# EAGLE design apr-27 (EAGLE 7.6.0)
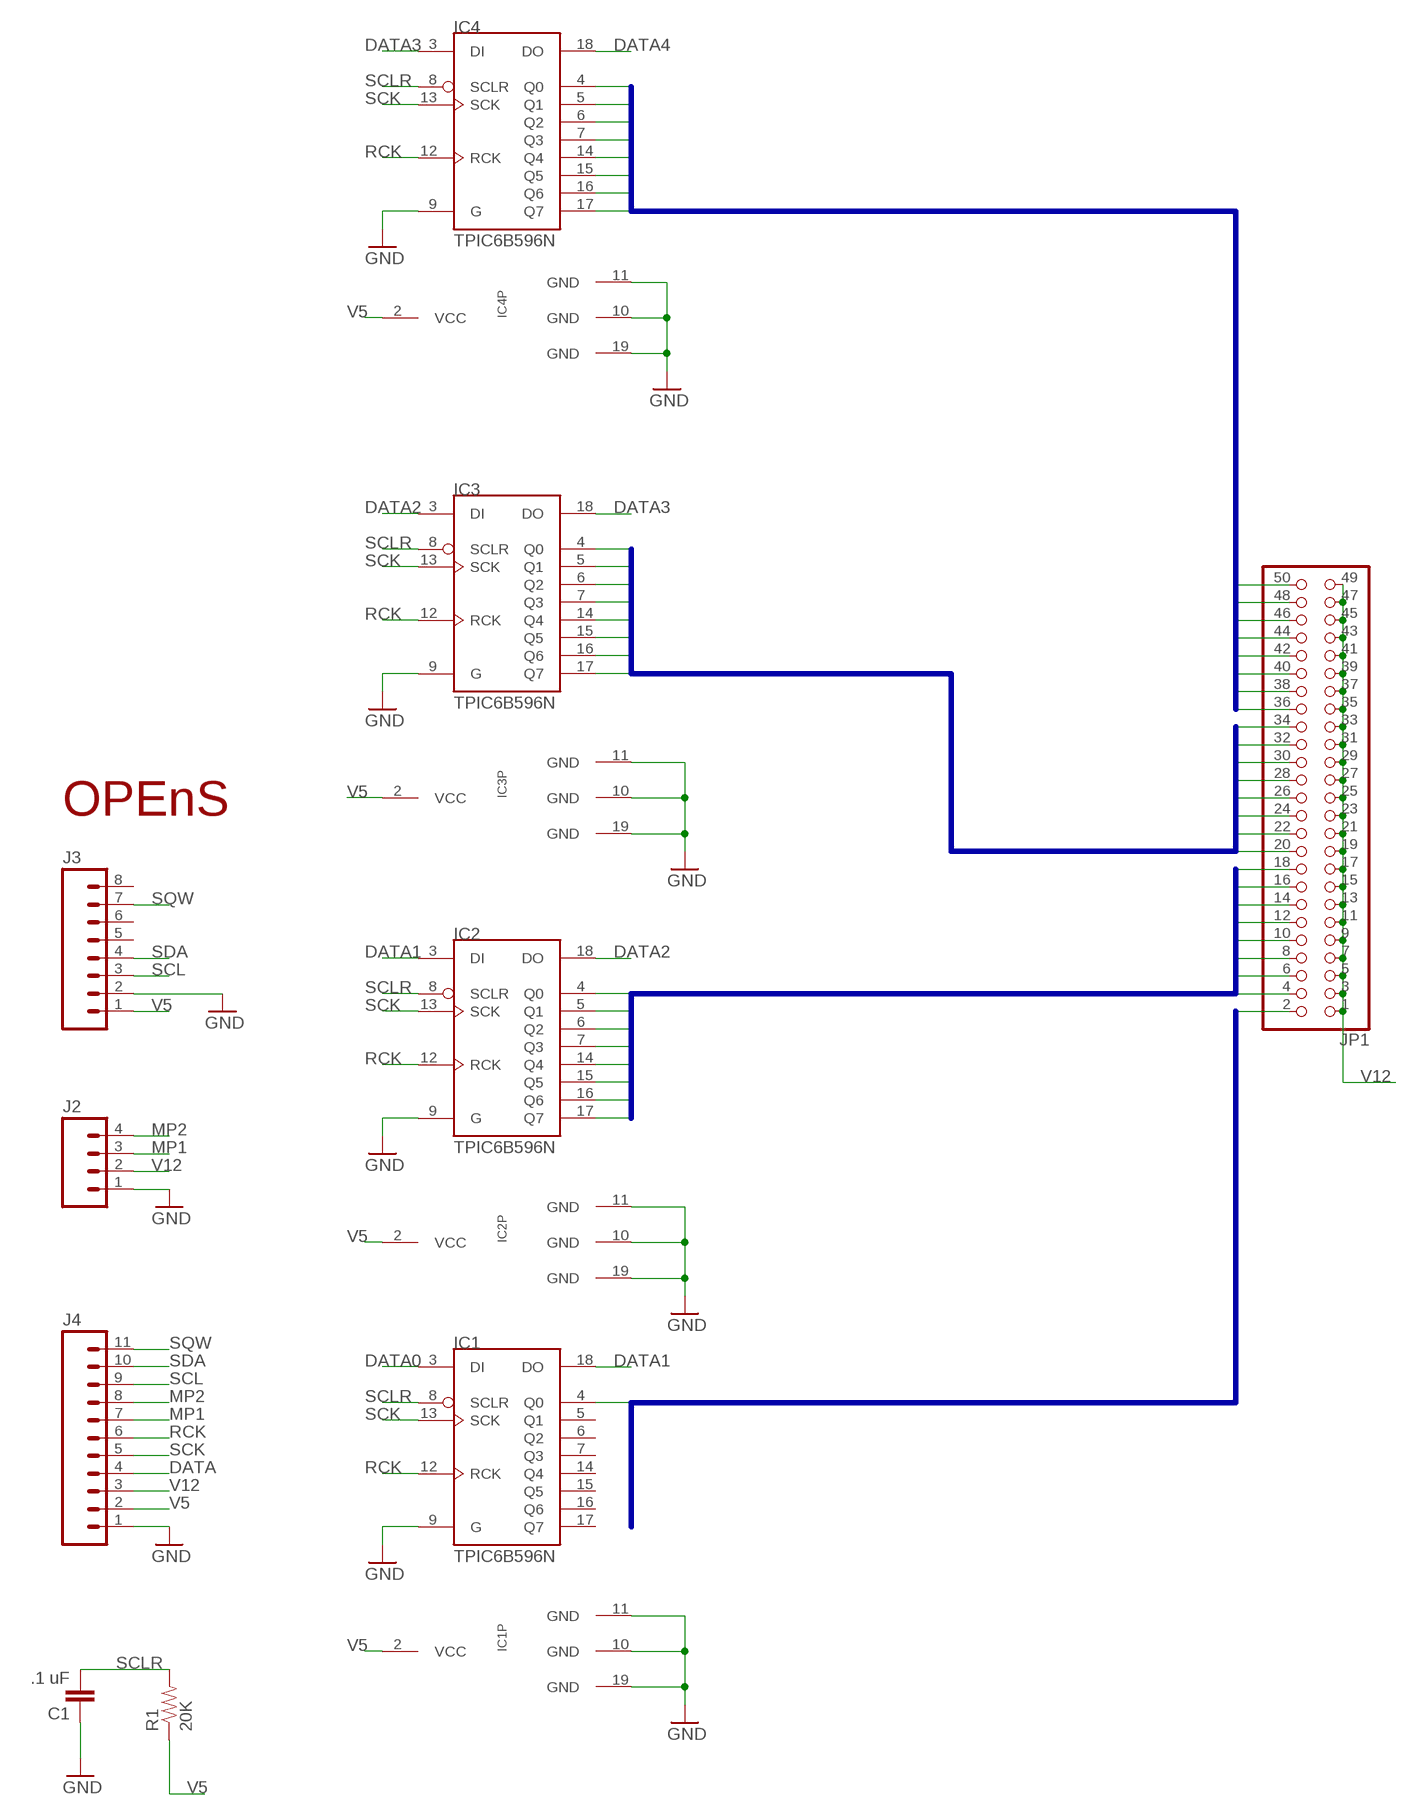
[diagram p0: schematic, sheet 1]

## Parts
C1  .1 uF  CAP_  [AXIAL-5MM]
IC1  TPIC6B596N  [DIL20]
IC2  TPIC6B596N  [DIL20]
IC3  TPIC6B596N  [DIL20]
IC4  TPIC6B596N  [DIL20]
J2  M04PTH  [1X04]
J3  M08  [1X08_ROUND]
J4  M11PTH  [1X11]
JP1  PINHD-2X25  [2X25]
R1  20K  RESISTORPTH-1/4W  [AXIAL-0.4]
U$1  OPENS-LOGO  [OPENS-LOGO]

## Nets
DATA: J4.4
DATA0: IC1.3(DI)
DATA1: IC1.18(DO) IC2.3(DI)
DATA2: IC2.18(DO) IC3.3(DI)
DATA3: IC3.18(DO) IC4.3(DI)
DATA4: IC4.18(DO)
GND: C1.P$1 IC1.9(G) IC1.10(GND) IC1.11(GND) IC1.19(GND) IC2.9(G) IC2.10(GND) IC2.11(GND) IC2.19(GND) IC3.9(G) IC3.10(GND) IC3.11(GND) IC3.19(GND) IC4.9(G) IC4.10(GND) IC4.11(GND) IC4.19(GND) J2.1 J3.2 J4.1
MP1: J2.3 J4.7
MP2: J2.4 J4.8
Q0: IC1.4(Q0) JP1.2
Q1: IC2.4(Q0) JP1.4
Q2: IC2.5(Q1) JP1.6
Q3: IC2.6(Q2) JP1.8
Q4: IC2.7(Q3) JP1.10
Q5: IC2.14(Q4) JP1.12
Q6: IC2.15(Q5) JP1.14
Q7: IC2.16(Q6) JP1.16
Q8: IC2.17(Q7) JP1.18
Q9: IC3.4(Q0) JP1.20
Q10: IC3.5(Q1) JP1.22
Q11: IC3.6(Q2) JP1.24
Q12: IC3.7(Q3) JP1.26
Q13: IC3.14(Q4) JP1.28
Q14: IC3.15(Q5) JP1.30
Q15: IC3.16(Q6) JP1.32
Q16: IC3.17(Q7) JP1.34
Q17: IC4.4(Q0) JP1.36
Q18: IC4.5(Q1) JP1.38
Q19: IC4.6(Q2) JP1.40
Q20: IC4.7(Q3) JP1.42
Q21: IC4.14(Q4) JP1.44
Q22: IC4.15(Q5) JP1.46
Q23: IC4.16(Q6) JP1.48
Q24: IC4.17(Q7) JP1.50
RCK: IC1.12(RCK) IC2.12(RCK) IC3.12(RCK) IC4.12(RCK) J4.6
SCK: IC1.13(SCK) IC2.13(SCK) IC3.13(SCK) IC4.13(SCK) J4.5
SCL: J3.3 J4.9
SCLR: C1.P$2 IC1.8(SCLR) IC2.8(SCLR) IC3.8(SCLR) IC4.8(SCLR) R1.P$2
SDA: J3.4 J4.10
SQW: J3.7 J4.11
V5: IC1.2(VCC) IC2.2(VCC) IC3.2(VCC) IC4.2(VCC) J3.1 J4.2 R1.P$1
V12: J2.2 J4.3 JP1.1 JP1.3 JP1.5 JP1.7 JP1.9 JP1.11 JP1.13 JP1.15 JP1.17 JP1.19 JP1.21 JP1.23 JP1.25 JP1.27 JP1.29 JP1.31 JP1.33 JP1.35 JP1.37 JP1.39 JP1.41 JP1.43 JP1.45 JP1.47 JP1.49
Unconnected: IC1.5(Q1) IC1.6(Q2) IC1.7(Q3) IC1.14(Q4) IC1.15(Q5) IC1.16(Q6) IC1.17(Q7) J3.5 J3.6 J3.8

## Buses
Q0
Q[1..8]
Q[9..16]
Q[17..24]

## Library data of the parts
C1 = SparkFun-Capacitors:CAP: Capacitor Standard 0603 ceramic capacitor, and 0.1" leaded capacitor.
IC1-IC4 = tpic:TPIC6B596
J2 = SparkFun-Connectors:M04: Header 4 Standard 4-pin 0.1" header. Use with straight break away headers (SKU : PRT-00116), right angle break away headers (PRT-00553), swiss pins (PRT-00743), machine pins (PRT-00117), and female headers (PRT-00115). Molex polarized connector foot print use with SKU : PRT-08231 with associated crimp pins and housings. 1MM SMD Version SKU: PRT-10208; PROD_ID: CONN-09696
J3 = SparkFun-Connectors:M08: Header 8 Standard 8-pin 0.1" header. Use with straight break away headers (SKU : PRT-00116), right angle break away headers (PRT-00553), swiss pins (PRT-00743), machine pins (PRT-00117), and female headers (PRT-00115).; PROD_ID: CONN-08437
J4 = SparkFun-Connectors:M11: Header 11 Standard 11-pin 0.1" header. Use with straight break away headers (SKU : PRT-00116), right angle break away headers (PRT-00553), swiss pins (PRT-00743), machine pins (PRT-00117), and female headers (PRT-00115).
JP1 = pinhead:PINHD-2X25: PIN HEADER
R1 = SparkFun-Passives:RESISTOR: Resistor Basic schematic elements and footprints for 0603, 1206, and PTH resistors.
U$1 = opens-logo:OPENS-LOGO: OPENS Lab Logo

## Board
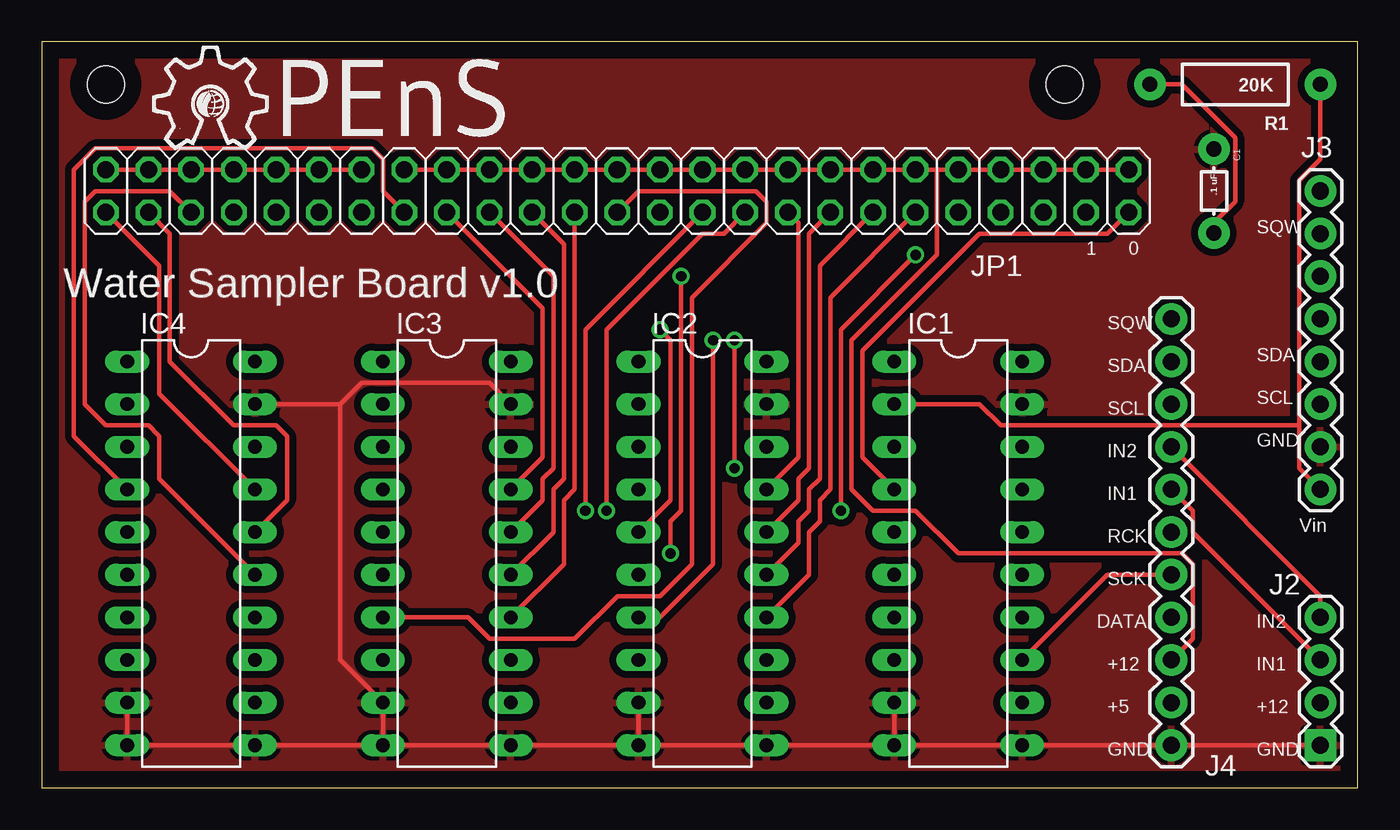
[diagram p1: board, top side]
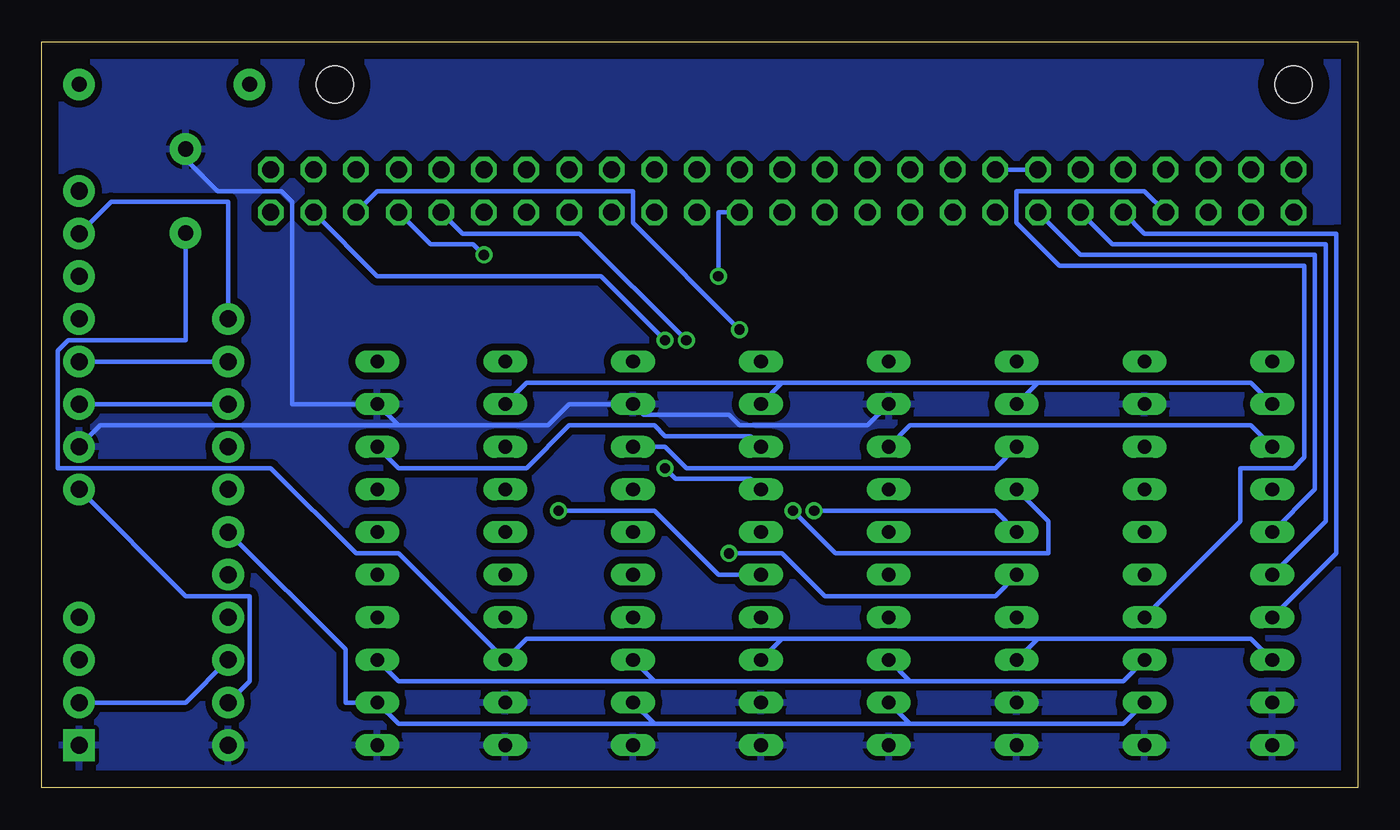
[diagram p2: board, bottom side, seen from below]

Size 78.41 x 44.44 mm. Coordinates in mm from the lower left corner, seen from the top.
Outline: 0,0 78.41,0 78.41,44.44 0,44.44 0,0
Copper layers (1*16): Top 0.035mm / dielectric 1.5mm / Bottom 0.035mm
Design rules "default": minimum track width 10mil, minimum drill 24mil, track to track 8mil, track to pad 8mil, pad to pad 8mil, via to via 8mil, smd to smd 8mil, copper to edge 40mil, drill to drill 8mil, minimum pad ring 10mil, minimum via ring 8mil, stop-mask expansion 4mil, vias tented up to drill 0mil, thermal gap 10mil
Holes 2.2 mm at 3.81,41.91 60.96,41.91

### Footprints (pad centres in the part's own frame; a part is rotated, then mirrored left to right if it is on the bottom)
AXIAL-5MM = drill 0.9 pad 1.88: P$1 -2.5,0; P$2 2.5,0
DIL20 = drill 0.813 long: 1 -11.43,-3.81; 2 -8.89,-3.81; 3 -6.35,-3.81; 4 -3.81,-3.81; 5 -1.27,-3.81; 6 1.27,-3.81; 7 3.81,-3.81; 8 6.35,-3.81; 9 8.89,-3.81; 10 11.43,-3.81; 11 11.43,3.81; 12 8.89,3.81; 13 6.35,3.81; 14 3.81,3.81; 15 1.27,3.81; 16 -1.27,3.81; 17 -3.81,3.81; 18 -6.35,3.81; 19 -8.89,3.81; 20 -11.43,3.81
1X04 = drill 1.016 pad 1.88 square: 1 0,0 | drill 1.016 pad 1.88: 2 2.54,0; 3 5.08,0; 4 7.62,0
1X08_ROUND = drill 1.016 pad 1.88: 1 0,0; 2 2.54,0; 3 5.08,0; 4 7.62,0; 5 10.16,0; 6 12.7,0; 7 15.24,0; 8 17.78,0
1X11 = drill 1.016 pad 1.88: 1 0,0; 2 2.54,0; 3 5.08,0; 4 7.62,0; 5 10.16,0; 6 12.7,0; 7 15.24,0; 8 17.78,0; 9 20.32,0; 10 22.86,0; 11 25.4,0
2X25 = drill 1.016 octagon: 1 -30.48,-1.27; 2 -30.48,1.27; 3 -27.94,-1.27; 4 -27.94,1.27; 5 -25.4,-1.27; 6 -25.4,1.27; 7 -22.86,-1.27; 8 -22.86,1.27; 9 -20.32,-1.27; 10 -20.32,1.27; 11 -17.78,-1.27; 12 -17.78,1.27; 13 -15.24,-1.27; 14 -15.24,1.27; 15 -12.7,-1.27; 16 -12.7,1.27; 17 -10.16,-1.27; 18 -10.16,1.27; 19 -7.62,-1.27; 20 -7.62,1.27; 21 -5.08,-1.27; 22 -5.08,1.27; 23 -2.54,-1.27; 24 -2.54,1.27; 25 0,-1.27; 26 0,1.27; 27 2.54,-1.27; 28 2.54,1.27; 29 5.08,-1.27; 30 5.08,1.27; 31 7.62,-1.27; 32 7.62,1.27; 33 10.16,-1.27; 34 10.16,1.27; 35 12.7,-1.27; 36 12.7,1.27; 37 15.24,-1.27; 38 15.24,1.27; 39 17.78,-1.27; 40 17.78,1.27; 41 20.32,-1.27; 42 20.32,1.27; 43 22.86,-1.27; 44 22.86,1.27; 45 25.4,-1.27; 46 25.4,1.27; 47 27.94,-1.27; 48 27.94,1.27; 49 30.48,-1.27; 50 30.48,1.27
AXIAL-0.4 = drill 0.9 pad 1.88: P$1 -5.08,0; P$2 5.08,0

### Placement (x,y rotation side)
C1  69.85,35.56 270 top
E$1  [OPENS-LOGO]  6.35,34.29 0 top
IC1  54.61,13.97 270 top
IC2  39.37,13.97 270 top
IC3  24.13,13.97 270 top
IC4  8.89,13.97 270 top
J2  76.2,2.54 90 top
J3  76.2,17.78 90 top
J4  67.31,2.54 90 top
JP1  34.29,35.56 180 top
R1  71.12,41.91 180 top

### Tracks (layer width: path | path; a pad name or v marks a point on that pad's centre or on a via)
DATA1
  Bottom 0.254: IC2.3 36.2,20.95 41.27,20.95 41.91,21.59 46.99,21.59 49.53,19.05 57.15,19.05 IC1.18
DATA2
  Bottom 0.254: IC3.3 21.59,19.05 40.01,19.05 41.27,20.32 IC2.18
DATA3
  Bottom 0.254: IC4.3 6.35,21.59 26.67,21.59 IC3.18
GND
  Top 0.254: IC4.9 IC4.10 IC4.11 IC3.10 | IC3.10 IC3.9 17.78,7.62 17.78,22.86 | IC3.10 IC3.11 IC2.10 | IC2.9 IC2.10 | IC2.10 IC2.11 IC1.10 | IC1.9 IC1.10 | IC1.10 IC1.11 J4.1 J2.1 | 17.78,22.86 IC4.19 | 17.78,22.86 19.05,24.13 26.67,24.13 IC3.19
  Bottom 0.254: IC3.19 29.21,21.59 36.83,21.59 37.47,22.23 42.55,22.23 IC2.19 46.99,22.86 48.26,21.59 57.15,21.59 | 57.15,21.59 IC1.19 63.5,22.86 63.5,34.92 64.14,35.56 67.94,35.56 69.85,37.47 C1.P$1 | J3.2 74.93,21.59 57.15,21.59
  pour Bottom (isolate 0.406): 0,0 0,44.45 78.11,44.45 78.11,0
  pour Top (isolate 0.406): 0,44.45 0,0 78.11,0 78.11,44.45
MP1
  Top 0.254: J2.3 68.58,15.24 68.58,16.51 J4.7
MP2
  Top 0.254: J2.4 76.2,11.43 J4.8
Q0
  Top 0.254: IC1.4 48.9,19.68 48.9,26.04 55.88,33.02 63.5,33.02 JP1.2
Q1  (via drill 0.61)
  Top 0.254: v41.27,26.67 v41.27,19.05
  Bottom 0.254: IC2.4 36.2,18.41 40.64,18.41 v41.27,19.05 | v41.27,26.67 45.09,30.48 58.42,30.48 JP1.4
Q2  (via drill 0.61)
  Top 0.254: IC2.5 37.47,17.14 37.47,26.67 v36.83,27.3
  Bottom 0.254: v36.83,27.3 43.18,33.66 43.18,35.56 58.42,35.56 JP1.6
Q3  (via drill 0.61)
  Top 0.254: v47.62,16.51 47.62,27.3 v52.07,31.75
  Bottom 0.254: IC2.6 38.1,12.7 41.91,16.51 v47.62,16.51 | v52.07,31.75 52.7,32.38 55.24,32.38 JP1.8
Q4  (via drill 0.61)
  Top 0.254: IC2.7 36.83,10.16 40.01,13.34 v40.01,26.67
  Bottom 0.254: v40.01,26.67 46.35,33.02 53.34,33.02 JP1.10
Q5
  Top 0.254: IC2.14 45.72,12.7 45.72,15.24 46.35,15.88 46.35,17.14 46.99,17.78 46.99,29.21 JP1.12
Q6
  Top 0.254: IC2.15 45.09,14.61 45.09,15.88 45.72,16.51 45.72,17.78 46.35,18.41 46.35,31.11 JP1.14
Q7
  Top 0.254: IC2.16 45.09,17.14 45.09,18.41 45.72,19.05 45.72,33.02 JP1.16
Q8
  Top 0.254: IC2.17 45.09,19.68 45.09,33.66 JP1.18
Q9  (via drill 0.61)
  Top 0.254: v33.66,16.51 33.66,27.3 39.37,33.02 40.64,33.02 JP1.20
  Bottom 0.254: IC3.4 18.41,15.88 18.41,13.97 31.11,13.97 v33.66,16.51
Q10  (via drill 0.61)
  Top 0.254: v32.38,16.51 32.38,27.3 JP1.22
  Bottom 0.254: IC3.5 21.59,16.51 v32.38,16.51
Q11  (via drill 0.61)
  Top 0.254: v37.47,13.97 37.47,15.88 38.1,16.51 v38.1,30.48
  Bottom 0.254: IC3.6 21.59,11.43 31.75,11.43 34.29,13.97 v37.47,13.97 | v38.1,30.48 38.1,34.29 JP1.24
Q12
  Top 0.254: IC3.7 25.4,10.16 26.67,8.89 31.75,8.89 34.29,11.43 36.83,11.43 38.73,13.34 38.73,29.21 43.18,33.66 43.18,34.92 42.55,35.56 35.56,35.56 JP1.26
Q13
  Top 0.254: IC3.14 31.11,13.34 31.11,17.14 31.75,17.78 JP1.28
Q14
  Top 0.254: IC3.15 30.48,15.24 30.48,17.78 31.11,18.41 31.11,32.38 JP1.30
Q15
  Top 0.254: IC3.16 29.84,17.14 29.84,18.41 30.48,19.05 30.48,30.48 JP1.32
Q16
  Top 0.254: IC3.17 29.84,19.68 29.84,28.57 JP1.34
Q17
  Top 0.254: IC4.4 1.91,20.95 1.91,36.83 3.17,38.1 19.68,38.1 20.32,37.47 20.32,35.56 JP1.36
Q18
  Bottom 0.254: IC4.5 2.54,17.78 2.54,31.75 16.51,31.75 JP1.38
Q19
  Bottom 0.254: IC4.6 1.91,15.88 1.91,32.38 14.61,32.38 JP1.40
Q20
  Bottom 0.254: IC4.7 1.27,13.97 1.27,33.02 12.7,33.02 JP1.42
Q21
  Bottom 0.254: IC4.14 6.99,15.88 6.99,19.05 3.81,19.05 3.17,19.68 3.17,31.11 17.78,31.11 20.32,33.66 20.32,35.56 12.7,35.56 JP1.44
Q22
  Top 0.254: IC4.15 6.99,18.41 6.99,20.95 6.35,21.59 3.81,21.59 2.54,22.86 2.54,34.92 3.17,35.56 7.62,35.56 JP1.46
Q23
  Top 0.254: IC4.16 14.61,17.14 14.61,20.95 13.97,21.59 11.43,21.59 7.62,25.4 7.62,33.02 JP1.48
Q24
  Top 0.254: IC4.17 6.99,23.5 6.99,31.11 JP1.50
RCK
  Bottom 0.254: IC4.12 13.97,3.81 26.67,3.81 | IC3.12 26.67,3.81 | 41.91,3.81 IC2.12 | 26.67,3.81 41.91,3.81 | 41.91,3.81 57.15,3.81 IC1.12 60.33,5.08 60.33,8.26 J4.6
SCK
  Top 0.254: J4.5 63.5,12.7 IC1.13
  Bottom 0.254: IC4.13 13.97,6.35 26.67,6.35 | IC3.13 26.67,6.35 | 41.91,6.35 IC2.13 | 26.67,6.35 41.91,6.35 | IC1.13 57.15,6.35 41.91,6.35
SCL
  Bottom 0.254: J3.3 J4.9
SCLR
  Top 0.254: R1.P$2 67.94,41.91 71.12,38.73 71.12,34.92 69.85,33.66 C1.P$2
  Bottom 0.254: IC4.8 6.35,8.89 19.05,8.89 | IC3.8 19.05,8.89 | 34.29,8.89 IC2.8 | 19.05,8.89 34.29,8.89 | 34.29,8.89 49.53,8.89 IC1.8 57.15,13.97 59.69,13.97 64.77,19.05 77.47,19.05 77.47,26.04 76.83,26.67 69.85,26.67 C1.P$2
SDA
  Bottom 0.254: J3.4 J4.10
SQW
  Bottom 0.254: J4.11 67.31,34.92 74.3,34.92 J3.7
V5
  Top 0.254: R1.P$1 76.2,37.47 74.93,36.2 74.93,21.59 | 74.93,21.59 74.93,19.05 J3.1 | IC1.2 55.88,22.86 57.15,21.59 74.93,21.59
  Bottom 0.254: IC4.2 6.35,24.13 19.05,24.13 | IC3.2 19.05,24.13 | 34.29,24.13 IC2.2 | 19.05,24.13 34.29,24.13 | IC1.2 49.53,24.13 34.29,24.13 | J4.2 66.04,6.35 66.04,11.43 69.85,11.43 J3.1
V12
  Top 0.254: JP1.49 JP1.47 JP1.45 JP1.43 JP1.41 JP1.39 JP1.37 | JP1.35 JP1.33 JP1.31 JP1.29 JP1.27 JP1.25 JP1.23 JP1.21 JP1.19 JP1.17 JP1.15 JP1.13 JP1.11 53.34,36.83 | 53.34,36.83 JP1.9 JP1.7 JP1.5 JP1.3 JP1.1 | J4.3 68.58,8.89 68.58,13.34 67.94,13.97 54.61,13.97 52.07,16.51 49.53,16.51 48.26,17.78 48.26,26.67 53.34,31.75 53.34,36.83
  Bottom 0.254: J4.3 69.85,5.08 J2.2 | JP1.35 JP1.37

### Text on the board
tPlace: SQW | 1 | 0 | Water Sampler Board v1.0 | SQW | SDA | SDA | SCL | SCL | IN2 | GND | IN1 | RCK | Vin | SCK | DATA | IN2 | +12 | IN1 | +5 | +12 | GND | GND